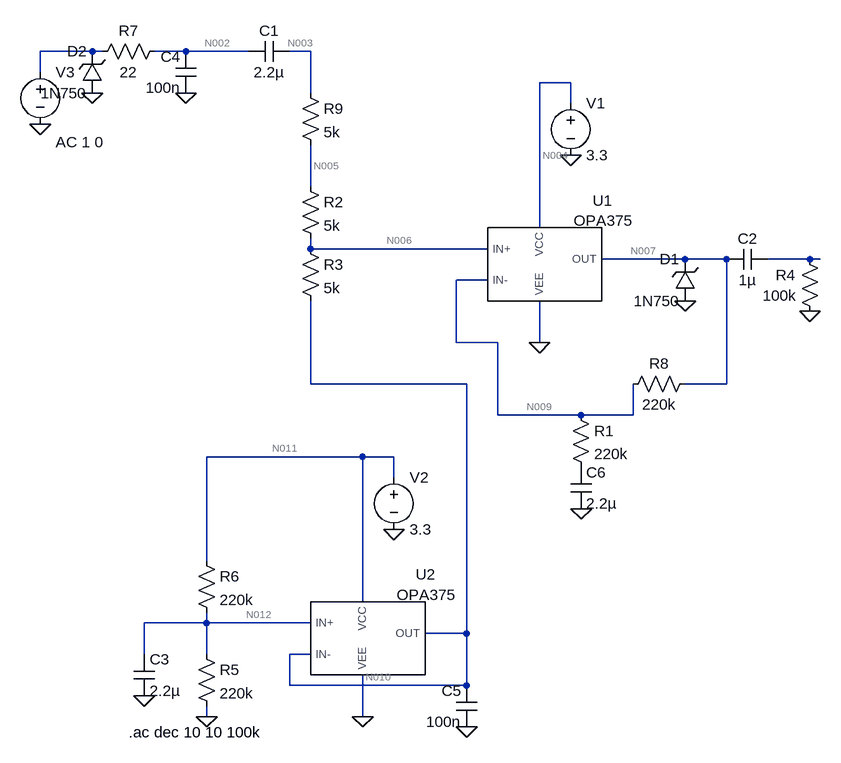
[diagram p0: schematic single_rail_amp_non.asc]
single_rail_amp_non.asc, the LTspice schematic file:
Version 4
SHEET 1 880 872
WIRE -528 -192 -608 -192
WIRE -512 -192 -528 -192
WIRE -384 -192 -432 -192
WIRE -288 -192 -384 -192
WIRE -192 -192 -224 -192
WIRE -608 -160 -608 -192
WIRE 208 -144 160 -144
WIRE -192 -128 -192 -192
WIRE 208 -112 208 -144
WIRE -192 16 -192 -48
WIRE 160 80 160 -144
WIRE -192 112 -192 96
WIRE 80 112 -192 112
WIRE 384 128 256 128
WIRE 448 128 384 128
WIRE 576 128 512 128
WIRE 592 128 576 128
WIRE 80 160 32 160
WIRE 32 256 32 160
WIRE 96 256 32 256
WIRE 160 256 160 192
WIRE -192 320 -192 192
WIRE 48 320 -192 320
WIRE 448 320 448 128
WIRE 448 320 384 320
WIRE 96 368 96 256
WIRE 224 368 96 368
WIRE 304 368 304 320
WIRE 304 368 224 368
WIRE -112 432 -352 432
WIRE -64 432 -112 432
WIRE -64 464 -64 432
WIRE -352 592 -352 432
WIRE -112 656 -112 432
WIRE -352 688 -352 672
WIRE -352 688 -448 688
WIRE -192 688 -352 688
WIRE 48 704 48 320
WIRE 48 704 -16 704
WIRE -448 736 -448 688
WIRE -352 736 -352 688
WIRE -192 736 -224 736
WIRE -224 784 -224 736
WIRE 48 784 48 704
WIRE 48 784 -224 784
WIRE -352 832 -352 816
WIRE -112 832 -112 768
FLAG 160 256 0
FLAG 208 -32 0
FLAG -112 832 0
FLAG -64 544 0
FLAG -448 800 0
FLAG -352 832 0
FLAG -608 -80 0
FLAG 576 208 0
FLAG -384 -128 0
FLAG 48 848 0
FLAG 384 192 0
FLAG -528 -128 0
FLAG 224 512 0
SYMBOL OPA375 144 144 R0
SYMATTR InstName U1
SYMBOL voltage 208 -128 R0
WINDOW 123 0 0 Left 0
WINDOW 39 0 0 Left 0
SYMATTR InstName V1
SYMATTR Value 3.3
SYMBOL cap -224 -208 R90
WINDOW 0 0 32 VBottom 2
WINDOW 3 32 32 VTop 2
SYMATTR InstName C1
SYMATTR Value 2.2µ
SYMBOL OPA375 -128 720 R0
SYMATTR InstName U2
SYMBOL voltage -64 448 R0
WINDOW 123 0 0 Left 0
WINDOW 39 0 0 Left 0
SYMATTR InstName V2
SYMATTR Value 3.3
SYMBOL res -368 720 R0
SYMATTR InstName R5
SYMATTR Value 220k
SYMBOL res -368 576 R0
SYMATTR InstName R6
SYMATTR Value 220k
SYMBOL cap -464 736 R0
SYMATTR InstName C3
SYMATTR Value 2.2µ
SYMBOL voltage -608 -176 R0
WINDOW 123 24 124 Left 2
WINDOW 39 0 0 Left 0
SYMATTR Value2 AC 1 0
SYMATTR InstName V3
SYMATTR Value ""
SYMBOL cap 512 112 R90
WINDOW 0 0 32 VBottom 2
WINDOW 3 32 32 VTop 2
SYMATTR InstName C2
SYMATTR Value 1µ
SYMBOL res 592 224 R180
WINDOW 0 38 72 Left 2
WINDOW 3 36 40 Left 2
SYMATTR InstName R4
SYMATTR Value 100k
SYMBOL res -528 -176 R270
WINDOW 0 32 56 VTop 2
WINDOW 3 0 56 VBottom 2
SYMATTR InstName R7
SYMATTR Value 22
SYMBOL cap -368 -128 R180
WINDOW 0 24 56 Left 2
WINDOW 3 24 8 Left 2
SYMATTR InstName C4
SYMATTR Value 100n
SYMBOL cap 64 848 R180
WINDOW 0 24 56 Left 2
WINDOW 3 24 8 Left 2
SYMATTR InstName C5
SYMATTR Value 100n
SYMBOL zener 400 192 R180
WINDOW 0 24 64 Left 2
WINDOW 3 24 0 Left 2
SYMATTR InstName D1
SYMATTR Value 1N750
SYMBOL zener -512 -128 R180
WINDOW 0 24 64 Left 2
WINDOW 3 24 0 Left 2
SYMATTR InstName D2
SYMATTR Value 1N750
SYMBOL res -208 0 R0
SYMATTR InstName R2
SYMATTR Value 5k
SYMBOL res -208 96 R0
SYMATTR InstName R3
SYMATTR Value 5k
SYMBOL res 208 352 R0
SYMATTR InstName R1
SYMATTR Value 220k
SYMBOL res 400 304 R90
WINDOW 0 0 56 VBottom 2
WINDOW 3 32 56 VTop 2
SYMATTR InstName R8
SYMATTR Value 220k
SYMBOL cap 208 448 R0
SYMATTR InstName C6
SYMATTR Value 2.2µ
SYMBOL res -208 -144 R0
SYMATTR InstName R9
SYMATTR Value 5k
TEXT -472 856 Left 2 !.ac dec 10 10 100k

The netlist it stands for:
* single_rail_amp_non.asc
XU1 N006 N009 N004 0 N007 OPA375  ; pins IN+ IN- VCC VEE OUT
V1 N004 0 3.3
C1 N003 N002 2.2µ
XU2 N012 N010 N011 0 N010 OPA375  ; pins IN+ IN- VCC VEE OUT
V2 N011 0 3.3
R5 N012 0 220k
R6 N011 N012 220k
C3 N012 0 2.2µ
V3 N001 0 AC 1 0
C2 N008 N007 1µ
R4 0 N008 100k
R7 N001 N002 22
C4 0 N002 100n
C5 0 N010 100n
D1 0 N007 1N750
D2 0 N001 1N750
R2 N005 N006 5k
R3 N006 N010 5k
R1 N009 P001 220k
R8 N007 N009 220k
C6 P001 0 2.2µ
R9 N003 N005 5k
.model D D
.lib standard.dio
.ac dec 10 10 100k
.lib C:\Users\mattr\Dokumenty\mateuszrjzr_stm\matiHome\simulation\OPA2375\fixed_models\opa375.lib
.backanno
.end

* Results of the author's LTspice run, read from the files saved beside the schematic
* Operating Point, zero values left out:
*   V(n007) = 1.65 V
*   V(n004) = 3.3 V
*   V(n009) = 1.65 V
*   V(n006) = 1.65 V
*   V(n003) = 1.65 V
*   V(n010) = 1.65 V
*   V(n011) = 3.3 V
*   V(n012) = 1.65 V
*   V(n005) = 1.65 V
*   V(p001) = 1.65 V
*   I(D1) = -748.6 nA
*   I(R3) = -10.02 pA
*   I(R6) = 7.5 µA
*   I(R5) = 7.5 µA
*   I(V2) = -857.5 µA
*   I(V1) = -850.7 µA
*   Ix(u1:IN+) = 10.04 pA
*   Ix(u1:VCC) = 850.7 µA
*   Ix(u1:VEE) = -850 µA
*   Ix(u1:OUT) = -748.6 nA
*   Ix(u2:IN+) = 9.859 pA
*   Ix(u2:VCC) = 850 µA
*   Ix(u2:VEE) = -850 µA
*   Ix(u2:OUT) = -10.06 pA
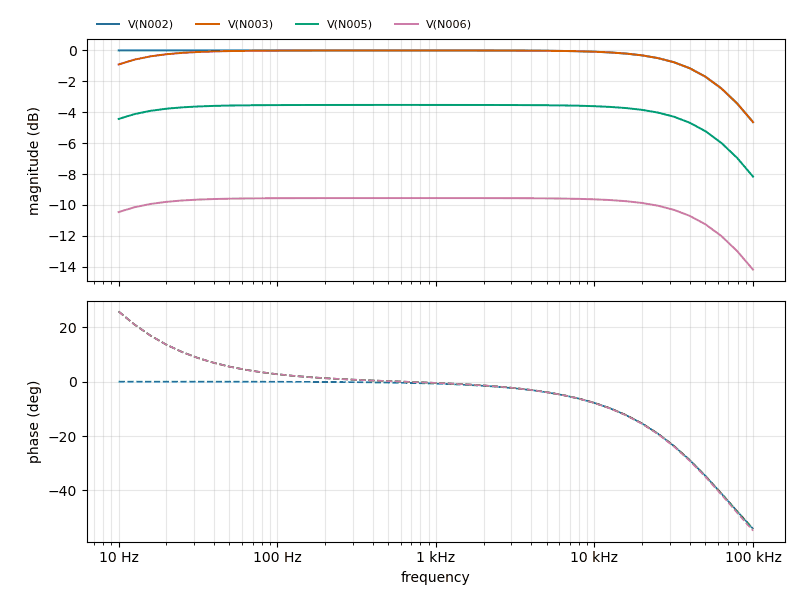
[diagram p1: AC Analysis of single_rail_amp_non.asc, plotted from the saved traces]
* AC Analysis, 1 run:
*   V(N002): -0.01 dB at 10 Hz, -4.64 dB at 100 kHz, peak -0.01 dB at 10 Hz, 3 dB below the peak at 71.94 kHz
*   V(N003): -0.92 dB at 10 Hz, -4.64 dB at 100 kHz, peak -0.01 dB at 631 Hz, 3 dB below the peak at 71.99 kHz
*   V(N005): -4.44 dB at 10 Hz, -8.17 dB at 100 kHz, peak -3.54 dB at 631 Hz, 3 dB below the peak at 71.99 kHz
*   V(N006): -10.46 dB at 10 Hz, -14.19 dB at 100 kHz, peak -9.56 dB at 631 Hz, 3 dB below the peak at 72 kHz